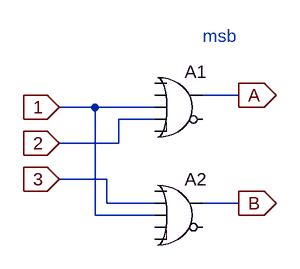
[diagram p0: schematic 3dec2bits.asc]
3dec2bits.asc, the LTspice schematic file:
Version 4
SHEET 1 880 680
WIRE 352 32 304 32
WIRE 160 48 112 48
WIRE 240 48 160 48
WIRE 240 64 192 64
WIRE 192 96 192 64
WIRE 192 96 112 96
WIRE 176 144 112 144
WIRE 176 176 176 144
WIRE 240 176 176 176
WIRE 352 176 304 176
WIRE 160 192 160 48
WIRE 240 192 160 192
FLAG 352 32 A
IOPIN 352 32 Out
FLAG 352 176 B
IOPIN 352 176 Out
FLAG 112 48 1
IOPIN 112 48 In
FLAG 112 96 2
IOPIN 112 96 In
FLAG 112 144 3
IOPIN 112 144 In
SYMBOL Digital\\or 272 -16 R0
SYMATTR InstName A1
SYMBOL Digital\\or 272 128 R0
SYMATTR InstName A2
TEXT 304 -48 Left 2 ;msb

The netlist it stands for:
* 3dec2bits.asc
A1 0 0 1 2 0 0 A 0 OR
A2 0 3 1 0 0 0 B 0 OR
* msb
.backanno
.end